# Altium schematic sheet PTFV_Block_Diagram.SchDoc: PTFV_Block_Diagram
size A4; DrawnBy: Aneesh Deshpande; DocumentNumber: 1; Revision: 1; SheetNumber: 1; SheetTotal: 1 of  5
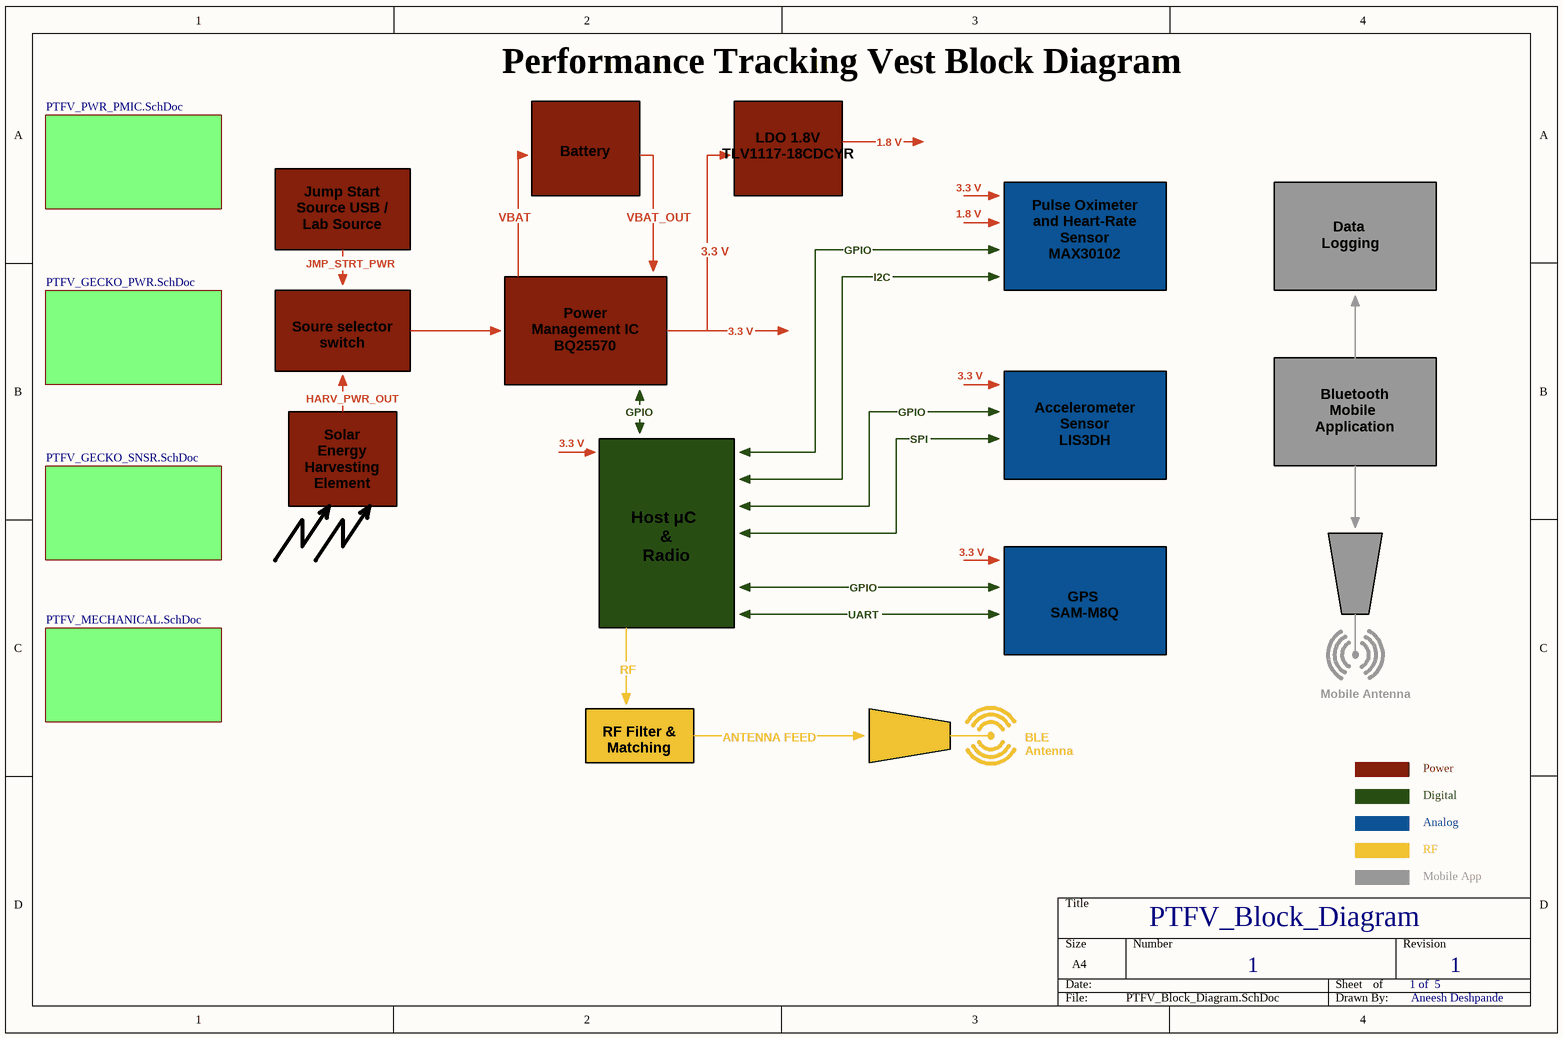
[diagram p0: PTFV_Block_Diagram.SchDoc]

## Sub-sheets
Designator = PTFV_PWR_PMIC.SchDoc: no entries
Designator = PTFV_GECKO_PWR.SchDoc: no entries
Designator = PTFV_GECKO_SNSR.SchDoc: no entries
Designator = PTFV_MECHANICAL.SchDoc: no entries

## Notes on the sheet
- Performance Tracking Vest Block Diagram
- Battery
- LDO 1.8V  TLV1117-18CDCYR
- 1.8 V
- Jump Start Source USB / Lab Source
- VBAT
- VBAT_OUT
- 3.3 V
- GPIO
- JMP_STRT_PWR
- I2C
- Pulse Oximeter and Heart-Rate Sensor
  MAX30102
- Data
  Logging
- Soure selector switch
- Power Management IC BQ25570
- HARV_PWR_OUT
- SPI
- Accelerometer
  Sensor
  LIS3DH
- Bluetooth
  Mobile
  Application
- Solar Energy Harvesting Element
- Host μC
  &
  Radio
- UART
- GPS
  SAM-M8Q
- RF
- Mobile Antenna
- RF Filter &
  Matching
- ANTENNA FEED
- BLE
  Antenna
- Power
- Digital
- Analog
- Mobile App